# EAGLE design PressureSensorShield (EAGLE 9.6.2)
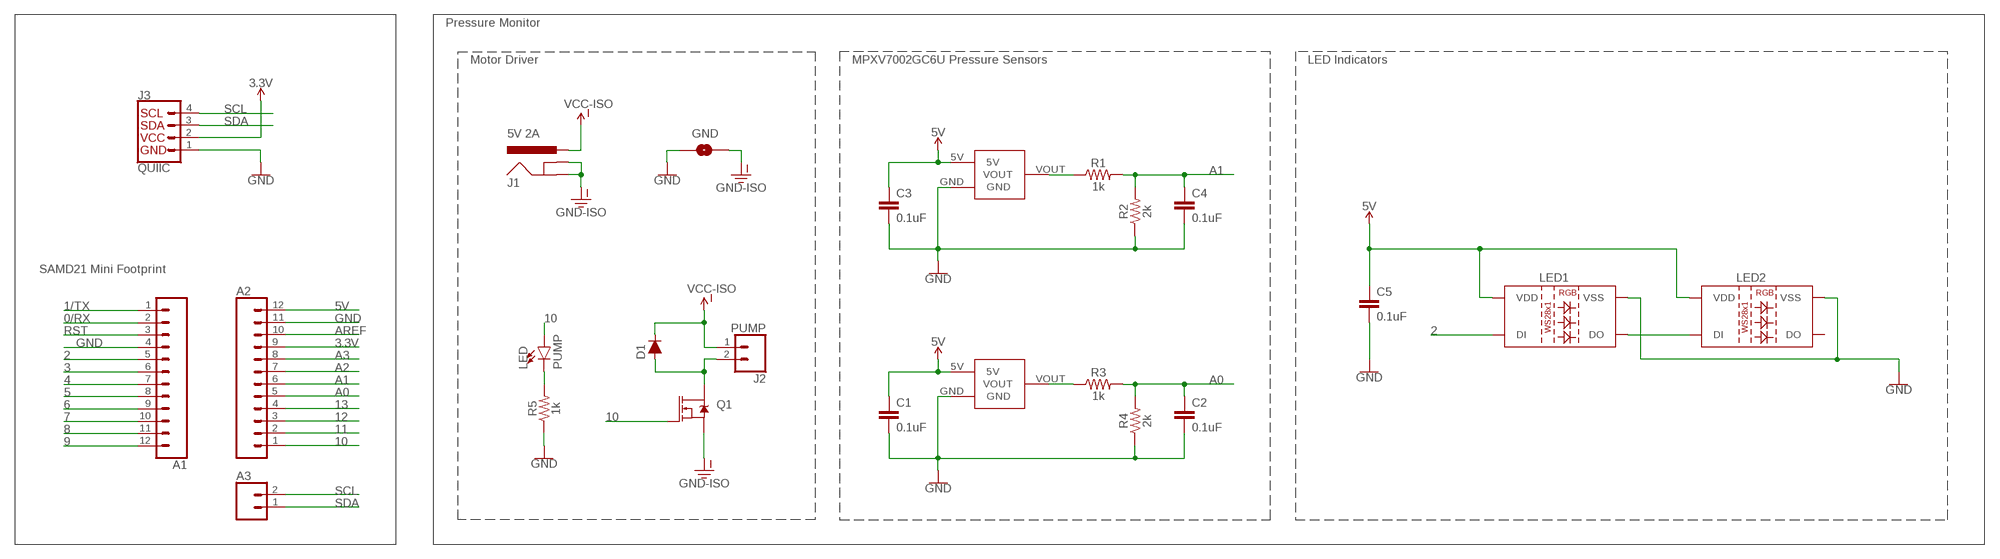
[diagram p0: schematic, sheet 1]

## Parts
A1  CONN_12  [1X12]
A2  CONN_12  [1X12]
A3  CONN_02  [1X02]
C1  0.1uF  0.1UF-KIT-EZ-50V-20%  [CAP-PTH-SMALL-KIT]
C2  0.1uF  0.1UF-KIT-EZ-50V-20%  [CAP-PTH-SMALL-KIT]
C3  0.1uF  0.1UF-KIT-EZ-50V-20%  [CAP-PTH-SMALL-KIT]
C4  0.1uF  0.1UF-KIT-EZ-50V-20%  [CAP-PTH-SMALL-KIT]
C5  0.1uF  0.1UF-KIT-EZ-50V-20%  [CAP-PTH-SMALL-KIT]
D1  DIODE-KIT  [DIODE-1N4148-KIT]
GND  JUMPER-SMT_2_NO_NO-SILK  [SMT-JUMPER_2_NO_NO-SILK]
J1  5V 2A  POWER_JACK  [POWER_JACK_PTH]
J2  PUMP  CONN_023.5MM  [SCREWTERMINAL-3.5MM-2]
J3  QUIIC  I2C_STANDARDQWIIC  [JST04_1MM_RA]
LED  PUMP  LED3MM  [LED_3MM]
LED1  WS2812B  [WS2812B]
LED2  WS2812B  [WS2812B]
Q1  MOSFET-NCH-FQP30N06L  [TO220V]
R1  1k  1KOHM-HORIZ_KIT-1/4W-1%  [AXIAL-0.3-KIT]
R2  2k  1KOHM-HORIZ_KIT-1/4W-1%  [AXIAL-0.3-KIT]
R3  1k  1KOHM-HORIZ_KIT-1/4W-1%  [AXIAL-0.3-KIT]
R4  2k  1KOHM-HORIZ_KIT-1/4W-1%  [AXIAL-0.3-KIT]
R5  1k  1KOHM-HORIZ_KIT-1/4W-1%  [AXIAL-0.3-KIT]
SENSOR  SENSOR 1  MPXV7002GC6T1  [SMALL_OUTLINE]
SENSOR2  SENSOR 2  MPXV7002GC6T1  [SMALL_OUTLINE]

## Nets
0/RX: A1.2
1/TX: A1.1
2: A1.5 LED1.4(DI)
3: A1.6
3.3V: A2.9 J3.2
4: A1.7
5: A1.8
5V: A2.12 C1.1 C3.1 C5.1 LED1.1(VDD) LED2.1(VDD) SENSOR2.5V SENSOR.5V
6: A1.9
7: A1.10
8: A1.11
9: A1.12
10: A2.1 LED.A Q1.1(G)
11: A2.2
12: A2.3
13: A2.4
A0: A2.5 C2.1 R3.P$2 R4.P$2
A1: A2.6 C4.1 R1.P$2 R2.P$2
A2: A2.7
A3: A2.8
AREF: A2.10
GND: A1.4 A2.11 C1.2 C2.2 C3.2 C4.2 C5.2 GND.1 J3.1 LED1.3(VSS) LED2.3(VSS) R2.P$1 R4.P$1 R5.P$1 SENSOR2.GND SENSOR.GND
GND-ISO: GND.2 J1.GND J1.GNDBREAK Q1.3(S)
N$1: LED.K(C) R5.P$2
N$2: R1.P$1 SENSOR2.VOUT
N$3: LED1.2(DO) LED2.4(DI)
N$4: R3.P$1 SENSOR.VOUT
N$6: D1.A J2.2 Q1.2(D)
RST: A1.3
SCL: A3.2 J3.4
SDA: A3.1 J3.3
VCC-ISO: D1.C J1.PWR J2.1
Unconnected: LED2.2(DO)

## Notes on the sheet
- Pressure Monitor
- Motor Driver | MPXV7002GC6U Pressure Sensors | LED Indicators
- SAMD21 Mini Footprint

## Library data of the parts
A1 A2 = SparkFun-Connectors:CONN_12: Multi connection point. Often used as Generic Header-pin footprint for 0.1 inch spaced/style header connections On any of the 0.1 inch spaced packages, you can populate with these: Break Away Headers - Straight <https://www.sparkfun.com/products/116> (PRT-00116) Break Away Male Headers - Right Angle <https://www.sparkfun.com/products/553> (PRT-00553) Female Headers <https://www.sparkfun.com/products/115> (PRT-00115) Break Away Headers - Machine Pin <https://www.sparkfun.com/products/117> (PRT-00117) Break Away Female Headers - Swiss Machine Pin <https://www.sparkfun.com/products/743> (PRT-00743) For SCREWTERMINALS and SPRING TERMINALS visit here: Screw Terimnals on SparkFun.com <https://www.sparkfun.com/search/results?term=Screw+Terminals> (5mm/3.5mm/2.54mm spacing) This device is also useful as a general connection point to wire up your design to another part of your project. Our various solder wires solder well into these plated through hole pads. Hook-Up Wire - Assortment (Stranded, 22 AWG) <https://www.sparkfun.com/products/11375> (PRT-11375) Hook-Up Wire - Assortment (Solid Core, 22 AWG) <https://www.sparkfun.com/products/11367> (PRT-11367) View the entire wire category on our website here <https://www.sparkfun.com/categories/141> Special notes: Molex polarized connector foot print use with SKU : PRT-08231 with associated crimp pins and housings. 1MM SMD Version SKU: PRT-10208 NOTES ON THE VARIANTS LOCK and LOCK_LONGPADS... This footprint was designed to help hold the alignment of a through-hole component (i.e. 6-pin header) while soldering it into place. You may notice that each hole has been shifted either up or down by 0.005 of an inch from it's more standard position (which is a perfectly straight line). This slight alteration caused the pins (the squares in the middle) to touch the edges of the holes. Because they are alternating, it causes a "brace" to hold the component in place. 0.005 has proven to be the perfect amount of "off-center" position when using our standard breakaway headers. Although looks a little odd when you look at the bare footprint, once you have a header in there, the alteration is very hard to notice. Also,if you push a header all the way into place, it is covered up entirely on the bottom side.
A3 = SparkFun-Connectors:CONN_02: Multi connection point. Often used as Generic Header-pin footprint for 0.1 inch spaced/style header connections On any of the 0.1 inch spaced packages, you can populate with these: Break Away Headers - Straight <https://www.sparkfun.com/products/116> (PRT-00116) Break Away Male Headers - Right Angle <https://www.sparkfun.com/products/553> (PRT-00553) Female Headers <https://www.sparkfun.com/products/115> (PRT-00115) Break Away Headers - Machine Pin <https://www.sparkfun.com/products/117> (PRT-00117) Break Away Female Headers - Swiss Machine Pin <https://www.sparkfun.com/products/743> (PRT-00743) For SCREWTERMINALS and SPRING TERMINALS visit here: Screw Terimnals on SparkFun.com <https://www.sparkfun.com/search/results?term=Screw+Terminals> (5mm/3.5mm/2.54mm spacing) This device is also useful as a general connection point to wire up your design to another part of your project. Our various solder wires solder well into these plated through hole pads. Hook-Up Wire - Assortment (Stranded, 22 AWG) <https://www.sparkfun.com/products/11375> (PRT-11375) Hook-Up Wire - Assortment (Solid Core, 22 AWG) <https://www.sparkfun.com/products/11367> (PRT-11367) View the entire wire category on our website here <https://www.sparkfun.com/categories/141> Special notes: Molex polarized connector foot print use with: PRT-08233 with associated crimp pins and housings. 2.54_SCREWTERM for use with PRT-10571. 3.5mm Screw Terminal footprints for PRT-08084 5mm Screw Terminal footprints for use with PRT-08432
C1-C5 = SparkFun-Capacitors:0.1UF: 0.1µF ceramic capacitors A capacitor is a passive two-terminal electrical component used to store electrical energy temporarily in an electric field.; PROD_ID: CAP-08370
D1 = SparkFun-DiscreteSemi:DIODE: Diode These are standard reverse protection diodes and small signal diodes. SparkFun Products: SparkFun SparkPunk Sound Kit <https://www.sparkfun.com/products/11177> SparkFun ESP8266 Thing <https://www.sparkfun.com/products/13231>; PROD_ID: DIO-08378; VALUE: 200mA/100V/1V
GND = SparkFun-Jumpers:JUMPER-SMT_2_NO: Normally open jumper This jumper has two pads in close proximity to each other. Apply solder to close the connection. Round pads are easier to solder for beginners, but are a lot larger. SparkFun Product that uses the round pads: SparkFun EL Sequencer <https://www.sparkfun.com/products/12781>
J1 = SparkFun-Connectors:POWER_JACK: Power Jack Connector This is the standard 5.5mm barrel jack for power. The PTH is the most common, proven, reliable, footprint. The Slot footprint only works if the mill layer is transmitted to the PCB fab house so be warned. Here are the connectors we sell at SparkFun: DC Barrel Power Jack/Connector <https://www.sparkfun.com/products/119> (PRT-00119) DC Barrel Power Jack/Connector (SMD) <https://www.sparkfun.com/products/12748> (PRT-12748) DC Barrel Jack Adapter - Breadboard Compatible <https://www.sparkfun.com/products/10811> (PRT-10811) It is used on this SparkFun product (and many, many others): SparkFun RedBoard - Programmed with Arduino <https://www.sparkfun.com/products/12757> (DEV-12757) Also, if you need a mating power supply or connector, please check these out: Wall Adapter Power Supply - 9VDC 650mA <https://www.sparkfun.com/products/298> (TOL-00298) DC Barrel Jack Adapter - Male <https://www.sparkfun.com/products/10287> (PRT-10287); PROD_ID: CONN-08197
J2 = SparkFun-Connectors:CONN_02: Multi connection point. Often used as Generic Header-pin footprint for 0.1 inch spaced/style header connections On any of the 0.1 inch spaced packages, you can populate with these: Break Away Headers - Straight <https://www.sparkfun.com/products/116> (PRT-00116) Break Away Male Headers - Right Angle <https://www.sparkfun.com/products/553> (PRT-00553) Female Headers <https://www.sparkfun.com/products/115> (PRT-00115) Break Away Headers - Machine Pin <https://www.sparkfun.com/products/117> (PRT-00117) Break Away Female Headers - Swiss Machine Pin <https://www.sparkfun.com/products/743> (PRT-00743) For SCREWTERMINALS and SPRING TERMINALS visit here: Screw Terimnals on SparkFun.com <https://www.sparkfun.com/search/results?term=Screw+Terminals> (5mm/3.5mm/2.54mm spacing) This device is also useful as a general connection point to wire up your design to another part of your project. Our various solder wires solder well into these plated through hole pads. Hook-Up Wire - Assortment (Stranded, 22 AWG) <https://www.sparkfun.com/products/11375> (PRT-11375) Hook-Up Wire - Assortment (Solid Core, 22 AWG) <https://www.sparkfun.com/products/11367> (PRT-11367) View the entire wire category on our website here <https://www.sparkfun.com/categories/141> Special notes: Molex polarized connector foot print use with: PRT-08233 with associated crimp pins and housings. 2.54_SCREWTERM for use with PRT-10571. 3.5mm Screw Terminal footprints for PRT-08084 5mm Screw Terminal footprints for use with PRT-08432; PROD_ID: CONN-08399
J3 = SparkFun-Connectors:I2C_STANDARD: SparkFun I2C Standard Pinout Header SparkFun has standardized on a pinout for all I2C based sensor breakouts. This pinout allows I2C boards to be plugged directly into the headers on Arduino Uno compatible boards, and to be daisy chained easily. Example SparkFun Products: SparkFun Atmospheric Sensor Breakout - BME280 <https://www.sparkfun.com/products/13676> SparkFun Altitude/Pressure Sensor Breakout - MPL3115A2 <https://www.sparkfun.com/products/11084> SparkFun TOF Range Finder Sensor - VL6180 <https://www.sparkfun.com/products/12785>; PROD_ID: CONN-13694; VALUE: Qwiic Right Angle
LED = SparkFun-LED:LED: LED (Generic) Standard schematic elements and footprints for 5mm, 3mm, 1206, and 0603 sized LEDs. Generic LEDs with no color specified.; PROD_ID: DIO-08794
LED1 LED2 = SparkFun-LED:WS2812B: WS2812B SMD addressable RGB LED 5x5mm SMD LED with built-in controller IC. Color: Red/Green/Blue mC Rating: RGB: 390, 660, 180 mcd Forward Voltage: RGB: 2.0, 3.0, 3.0 V Packages:WS2812B SparkFun Products: Blynk Board - ESP8266 <https://www.sparkfun.com/products/13794>; PROD_ID: DIO-12503; VALUE: WS2812B
Q1 = SparkFun-DiscreteSemi:MOSFET-NCH: N-channel MOSFETs Voltage controlled devices that allow control of high current outputs. SparkFun Products: SparkFun OpenScale <https://www.sparkfun.com/products/13261> SparkFun Digital Sandbox <https://www.sparkfun.com/products/12651> SparkFun Monster Moto Shield <https://www.sparkfun.com/products/10182> SparkFun MOSFET Power Controller <https://www.sparkfun.com/products/11214>; PROD_ID: TRANS-10060; VALUE: 60V/32A/35mΩ
R1 R3 R5 = SparkFun-Resistors:1KOHM: 1kΩ resistor A resistor is a passive two-terminal electrical component that implements electrical resistance as a circuit element. Resistors act to reduce current flow, and, at the same time, act to lower voltage levels within circuits. - Wikipedia; PROD_ID: RES-12182
R2 R4 = SparkFun-Resistors:1KOHM: 1kΩ resistor A resistor is a passive two-terminal electrical component that implements electrical resistance as a circuit element. Resistors act to reduce current flow, and, at the same time, act to lower voltage levels within circuits. - Wikipedia; PROD_ID: RES-12182; VALUE: 1k
SENSOR SENSOR2 = PressureSensors:MPXV7002GC6T1: MPXV7002GC6T1 Pressure Sensor ±0.29PSI Gauge Male - 0.13" (3.17mm) Tube, Top Port

## Board
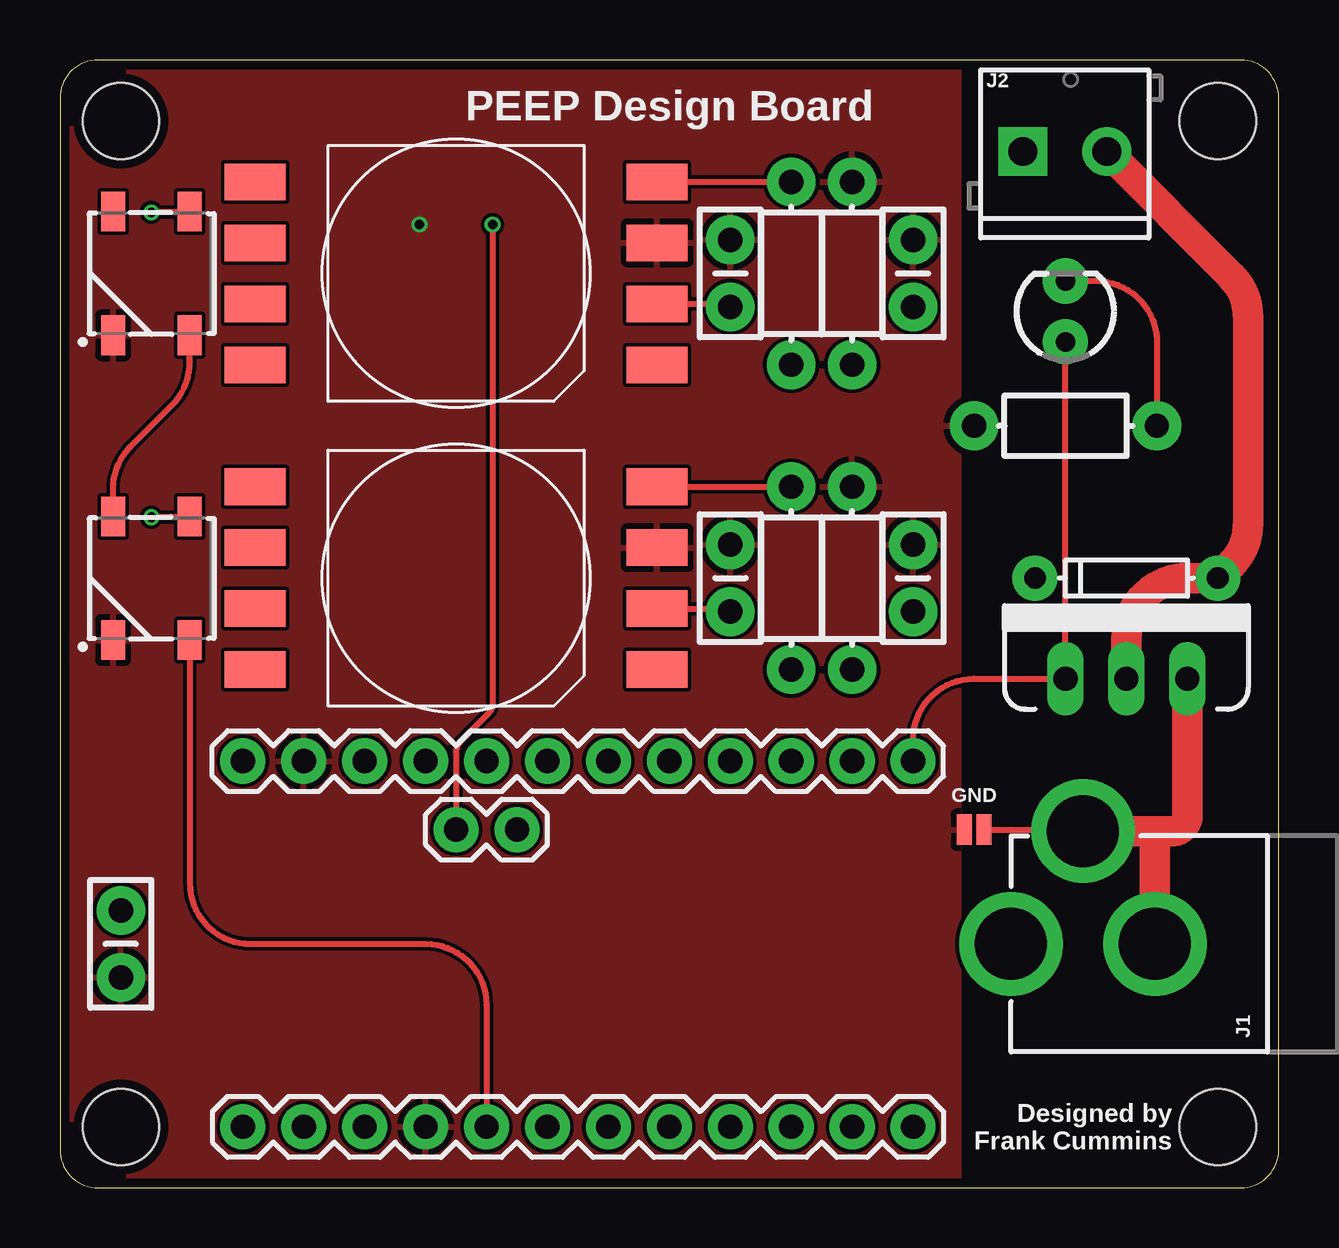
[diagram p1: board, top side]
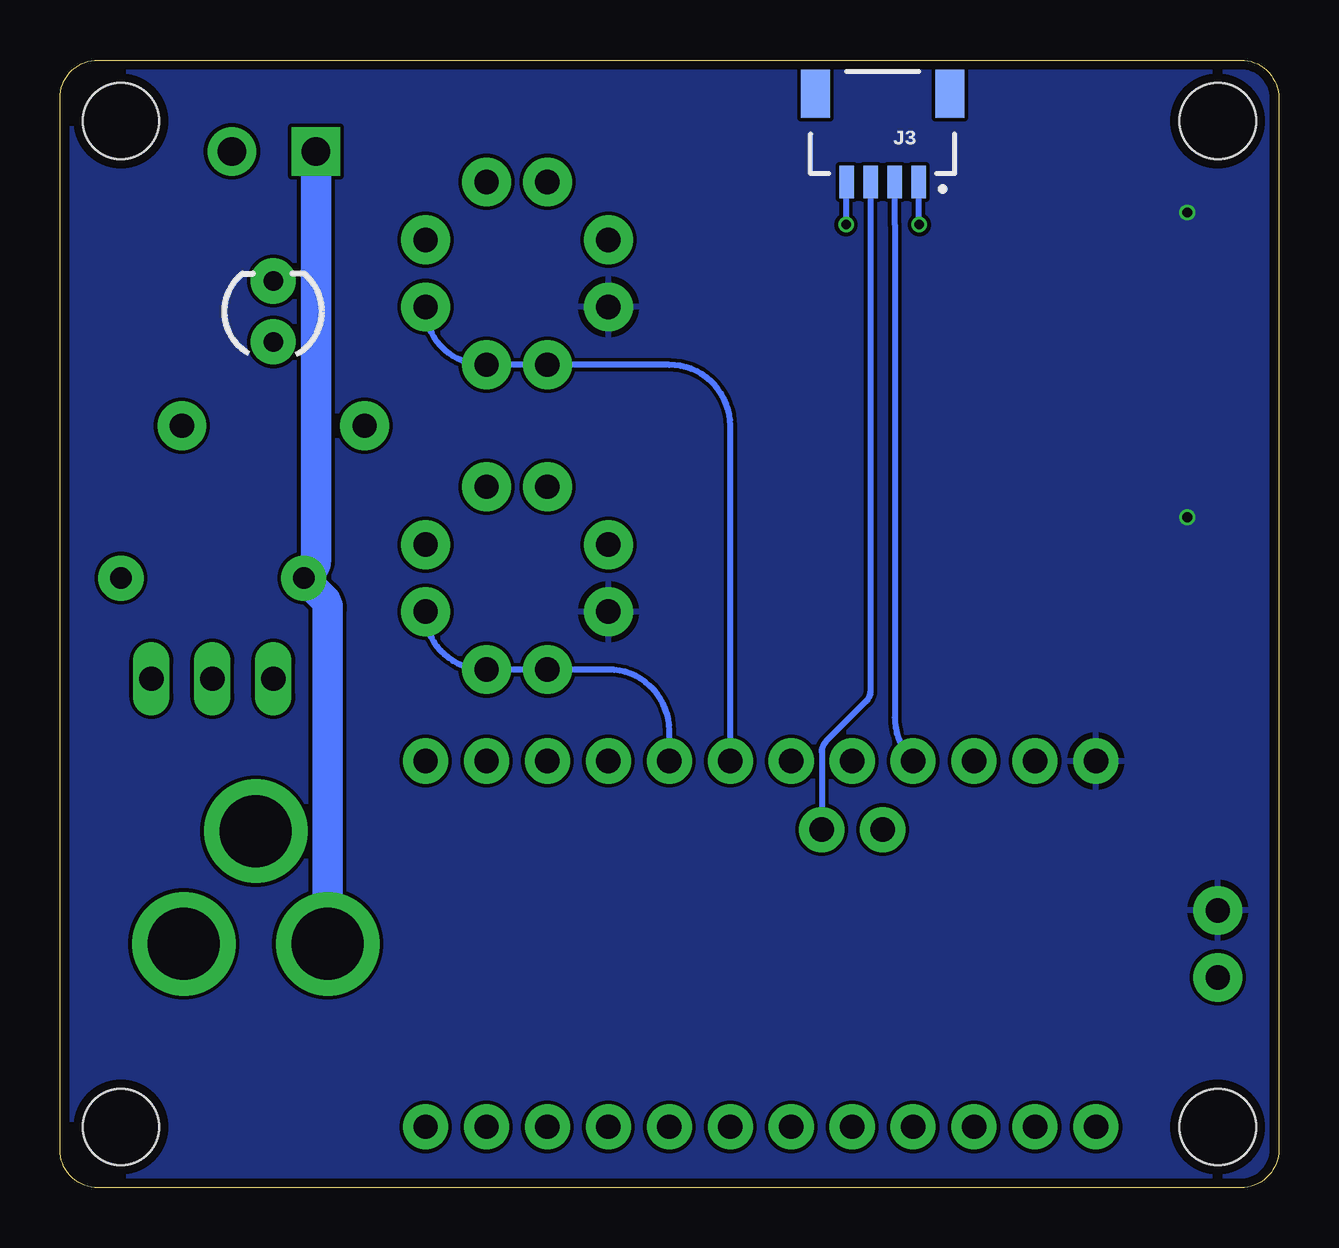
[diagram p2: board, bottom side, seen from below]

Size 50.8 x 46.99 mm. Coordinates in mm from the lower left corner, seen from the top.
Outline: 1.59,0 49.21,0 arc90 50.8,1.59 50.8,45.4 arc90 49.21,46.99 1.59,46.99 arc90 0,45.4 0,1.59 arc90 1.59,0
Copper layers (1*16): Top 0.035559375mm / dielectric 1.6mm / Bottom 0.035559375mm
Design rules "oshpark-2layer": minimum track width 6mil, minimum drill 10mil, track to track 6mil, track to pad 6mil, pad to pad 6mil, via to via 6mil, smd to smd 6mil, copper to edge 15mil, drill to drill 6mil, minimum pad ring 5mil, minimum via ring 5mil, stop-mask expansion 2.5mil, vias tented up to drill 0mil, thermal gap 10mil
Holes 3.17 mm at 2.54,2.54 2.54,44.45 48.26,44.45 48.26,2.54

### Footprints (pad centres in the part's own frame; a part is rotated, then mirrored left to right if it is on the bottom)
1X12 = drill 1.016 pad 1.88: 1 0,0; 2 2.54,0; 3 5.08,0; 4 7.62,0; 5 10.16,0; 6 12.7,0; 7 15.24,0; 8 17.78,0; 9 20.32,0; 10 22.86,0; 11 25.4,0; 12 27.94,0
1X02 = drill 1.016 pad 1.88: 1 0,0; 2 2.54,0
CAP-PTH-SMALL-KIT = drill 1.016 pad 2.032: 1 -1.397,0; 2 1.397,0
DIODE-1N4148-KIT = drill 0.9 pad 1.88: A -3.81,0; C 3.81,0
SMT-JUMPER_2_NO_NO-SILK = smd 0.635 x 1.27: 1 -0.406,0; 2 0.406,0
POWER_JACK_PTH = drill 2.997 pad 4.318: GND 0,7.7; GNDBREAK 4.7,10.7; PWR 0,13.7
SCREWTERMINAL-3.5MM-2 = drill 1.2 pad 2.032 square: 1 0,0 | drill 1.2 pad 2.032: 2 3.5,0
JST04_1MM_RA = smd 0.6 x 1.35: 1 -1.5,0; 2 -0.5,0; 3 0.5,0; 4 1.5,0 | smd 1.2 x 2: NC1 2.8,-3.675; NC2 -2.8,-3.675
LED_3MM = drill 0.813 pad 1.88: A -1.27,0; K 1.27,0
WS2812B = smd 1.651 x 1: 1 2.577,-1.6; 2 2.577,1.6; 3 -2.577,1.6; 4 -2.577,-1.6
TO220V = drill 1.016 long: 1 -2.54,0; 2 0,0; 3 2.54,0
AXIAL-0.3-KIT = drill 1.016 pad 2.032: P$1 -3.81,0; P$2 3.81,0
SMALL_OUTLINE = smd 2.54 x 1.524: 5V 8.382,-1.27; GND 8.382,1.27; NC_1 -8.382,3.81; NC_2 -8.382,1.27; NC_3 -8.382,-1.27; NC_4 -8.382,-3.81; NC_5 8.382,-3.81; VOUT 8.382,3.81

### Placement (x,y rotation side)
A1  7.62,2.54 0 top
A2  35.56,17.78 180 top
A3  19.05,14.92 180 top
C1  27.94,25.4 90 top
C2  35.56,25.4 90 top
C3  27.94,38.1 90 top
C4  35.56,38.1 90 top
C5  2.54,10.16 270 top
D1  44.45,25.4 180 top
GND  38.1,14.92 0 top
J1  53.34,10.16 90 top
J2  40.13,43.18 0 top
J3  16.51,41.91 180 bottom
LED  41.91,36.51 90 top
LED1  3.81,25.4 90 top
LED2  3.81,38.1 90 top
Q1  44.45,21.21 0 top
R1  30.48,38.1 270 top
R2  33.02,38.1 270 top
R3  30.48,25.4 270 top
R4  33.02,25.4 270 top
R5  41.91,31.75 0 top
SENSOR  16.51,25.4 0 top
SENSOR2  16.51,38.1 0 top

### Tracks (layer width: path | path; a pad name or v marks a point on that pad's centre or on a via)
2
  Top 0.254: LED1.4 5.41,12.7 arc90 7.95,10.16 15.24,10.16 arc-90 17.78,7.62 A1.5
3.3V
  Bottom 0.254: J3.2 16.01,40.14 arc-90 16,40.13 16,19.59 arc-45 15.26,17.8 A2.9
5V  (via drill 0.4)
  Top 0.254: SENSOR2.5V 27.81,36.83 arc-90 C3.1 | SENSOR.5V 27.81,24.13 arc-90 C1.1 | LED1.1 arc-45 5.32,27.94 v3.81,27.94 | LED2.1 arc-45 5.32,40.64 v3.81,40.64
  pour Bottom: 0,0 53.34,0 53.34,46.99 0,46.99
10
  Top 0.254: A2.1 35.56,18.67 arc-90 38.1,21.21 Q1.1 LED.A
A0
  Bottom 0.254: A2.5 25.4,19.05 arc-90 27.94,21.59 R3.P$2 R4.P$2 33.15,21.59 arc90 C2.1
A1
  Bottom 0.254: A2.6 22.86,31.75 arc-90 25.4,34.29 R1.P$2 R2.P$2 33.15,34.29 arc90 C4.1
GND  (via drill 0.4)
  Bottom 0.254: J3.1 15.01,40.16 arc-90 v14.99,40.13
  pour Top (rank 2): 0,0 37.47,0 37.47,46.99 0,46.99
GND-ISO
  Top 0.254: GND.2 42.49,14.92 arc-45 J1.GNDBREAK
  Top 1.27: Q1.3 46.99,15.49 arc-90 46.35,14.86 J1.GNDBREAK 45.01,14.86 arc-90 45.64,14.22 J1.GND
N$1
  Top 0.254: LED.K 43.18,37.78 arc-90 45.72,35.24 R5.P$2
N$2
  Top 0.254: SENSOR2.VOUT R1.P$1
N$3
  Top 0.254: LED1.2 2.21,29.1 arc-45 2.95,30.89 4.67,32.61 arc45 5.41,34.4 LED2.4
N$4
  Top 0.254: SENSOR.VOUT R3.P$1
N$6
  Top 1.27: J2.2 48.79,38.03 arc-45 49.53,36.23 49.53,27.72 arc-45 48.79,25.93 D1.A 46.99,25.4 arc90 44.45,22.86 Q1.2
SCL  (via drill 0.4)
  Top 0.254: v18.03,40.13 18.03,20.2 arc-45 17.85,19.75 16.7,18.6 arc45 16.51,18.15 A3.2
  Bottom 0.254: J3.4 arc-90 18.03,41.89 v18.03,40.13
SDA
  Bottom 0.254: J3.3 arc-90 J3.3 17.02,40.13 17.02,20.71 arc45 17.2,20.26 18.86,18.6 arc-45 19.05,18.15 A3.1
VCC-ISO
  Bottom 1.27: J1.PWR 39.64,24.14 arc-45 39.83,24.59 D1.C 40.32,25.72 arc-45 40.13,26.17 J2.1

### Text on the board
tNames: PEEP Design Board | Designed by / Frank Cummins